# Altium schematic sheet Power_Switch.SchDoc: Evaluation Board 3.2
size A3; Organization: Toradex AG; Address1: Altsagenstrasse 5; Address2: Horw; Address3: 6048; Address4: Switzerland; DocumentNumber: 3; Revision: V3.2; SheetNumber: 3; SheetTotal: 23; PageSetup: Record=PageOptions|CenterHorizontal=True|CenterVertical=True|PrintScale=0.73|XCorrection=1.00|YCorrection=1.00|PrintKind=0|BorderSize=5000000|LeftOffset=0|BottomOffset=0|Orientation=2|PaperLength=1000|PaperWidth=1000|Scale=100|PaperSource=7|PrintQuality=-4|MediaType=1|DitherType=10|PaperKind=A4|PrintScaleMode=1
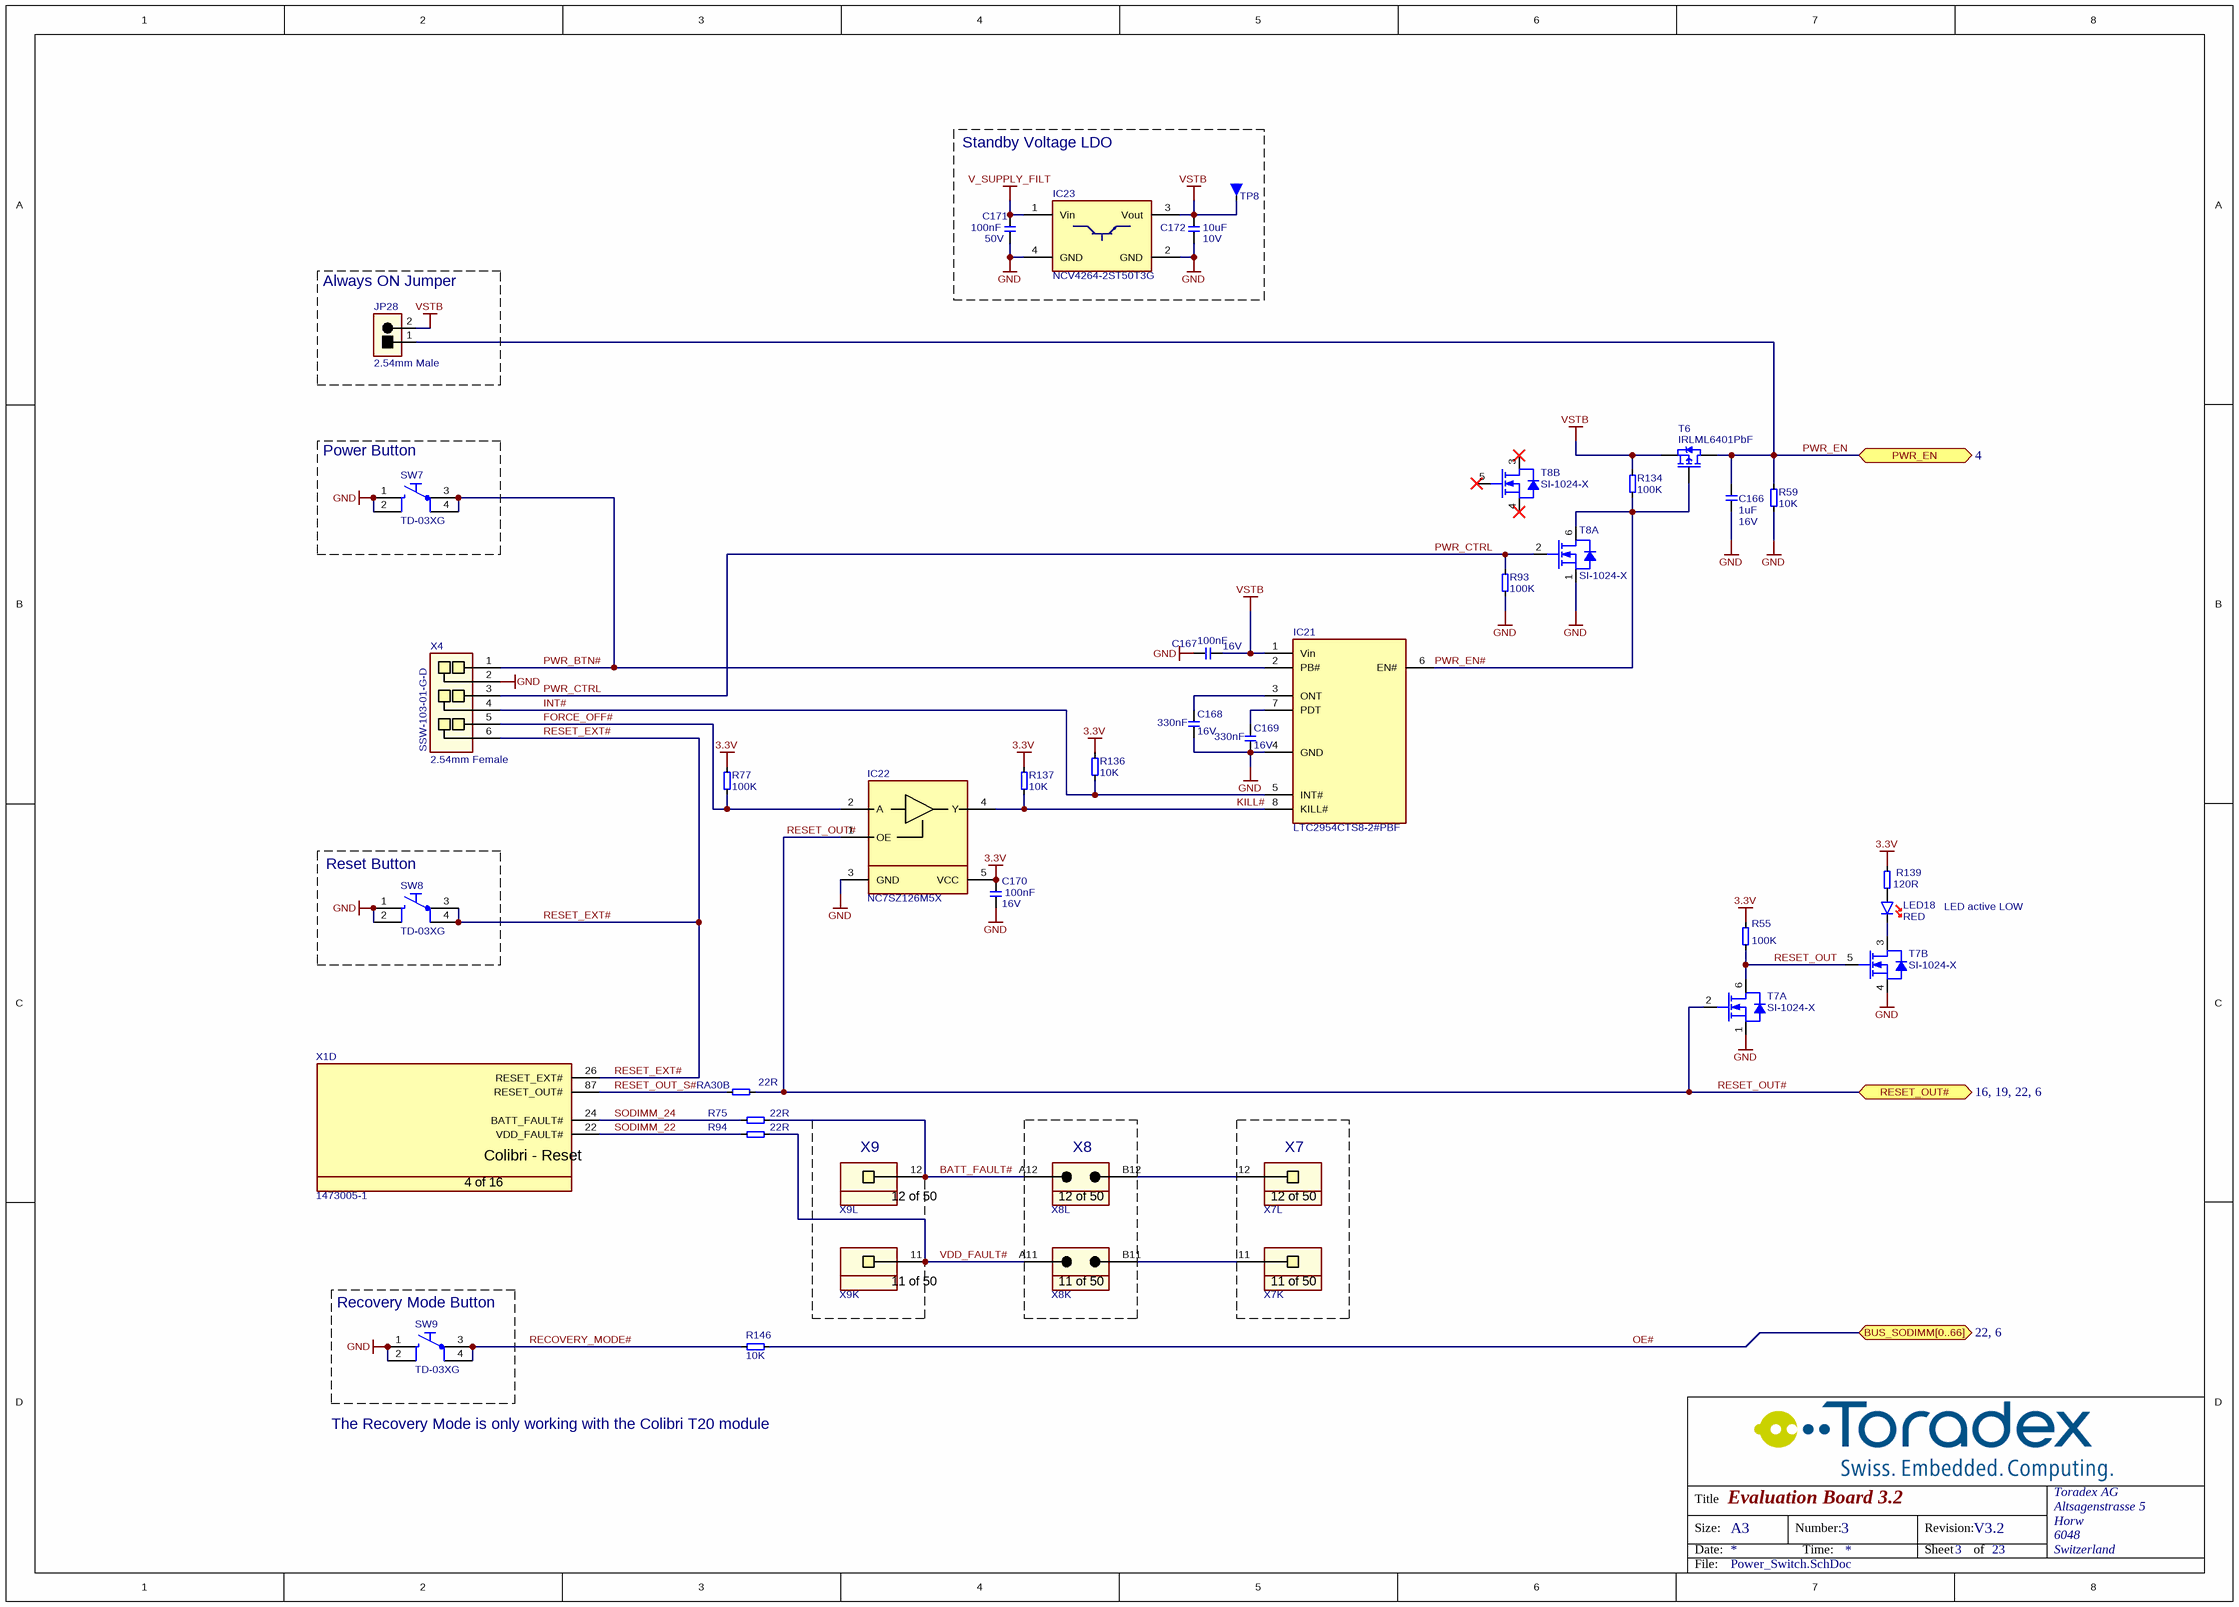
[diagram p0: Power_Switch.SchDoc]

## Parts
C166  Rating: 16V  [T_CAPC0603X33N]  (hidden comment: 1uF)
C167  Rating: 16V  [T_CAPC0603X33N]  (hidden comment: 100nF)
C168  Rating: 16V  [T_CAPC0805X125N]  (hidden comment: 330nF)
C169  Rating: 16V  [T_CAPC0805X125N]  (hidden comment: 330nF)
C170  Rating: 16V  [T_CAPC0603X33N]  (hidden comment: 100nF)
C171  Rating: 50V  [T_CAPC0603X33N]  (hidden comment: 100nF)
C172  Rating: 10V  [T_CAPC0805X125N]  (hidden comment: 10uF)
IC21  LTC2954CTS8-2#PBF  [T_LINEAR_LTC2954CTS8-2#PBF]
IC22  NC7SZ126M5X  [SOT95P279X142-5N]
IC23  NCV4264-2ST50T3G  [T_ON_NCV4264-2ST50T3G]
JP28  TSW-101-07-G-D  [T_Samtec_TSW-101-07-G-D]  (value not drawn)
LED18  Color: RED  [T_Osram_T670_RED]  (hidden comment: LS T670-K1L2-1)
R55  100K  [T_RESC0603X30N]
R59  10K  [T_RESC0603X30N]
R75  22R  [RESC1005X40N]
R77  100K  [T_RESC0603X30N]
R93  100K  [T_RESC0603X30N]
R94  22R  [RESC1005X40N]
R134  100K  [T_RESC0603X30N]
R136  10K  [T_RESC0603X30N]
R137  10K  [T_RESC0603X30N]
R139  120R  [T_RESC0603X30N]
R146  10K  [T_RESC0603X30N]
RA30  22R  [T_Resistor_Array_X4]  (part B of 4)
SW7  TD-03XG  [T_WMF_TD-03XG]
SW8  TD-03XG  [T_WMF_TD-03XG]
SW9  TD-03XG  [T_WMF_TD-03XG]
T6  IRLML6401PbF  [SOT95P237X112-3N]
T7  Manufacturer Part No.: SI-1024-X  [SOTFL50P160X60-6N]  (hidden comment: T-Vishay-SI-1024X-N)  (parts A,B of 2)
T8  Manufacturer Part No.: SI-1024-X  [SOTFL50P160X60-6N]  (hidden comment: T-Vishay-SI-1024X-N)  (parts A,B of 2)
TP8  Testpin  [T_TP-THT]  (value not drawn)
X1  Manufacturer Part No.: 1473005-1  [T_Tyco_1473005-1]  (hidden comment: CON-Tyco-1473005-1-200-0.6mm)  (part D of 16)
X4  Manufacturer Part No.: SSW-103-01-G-D  [T_Samtec_SSW-103-01-G-D]  (hidden comment: TSW-103-01-G-D)
X7  SSW-110-01-G-S  [T_Samtec_SSW-110-01-G-S]  (value not drawn)  (parts K,L of 50)
X8  TSW-110-07-G-D  [T_Samtec_TSW-110-07-G-D]  (value not drawn)  (parts K,L of 50)
X9  SSW-110-01-G-S  [T_Samtec_SSW-110-01-G-S]  (value not drawn)  (parts K,L of 50)

## Blocks framed on the sheet
Standby Voltage LDO: C171 C172 IC23 TP8
Always ON Jumper: JP28
Power Button: SW7
Reset Button: SW8
X9: X9
X8: X8
X7: X7
Recovery Mode Button: SW9

## Ports
BUS_SODIMM[0..66] (bidir, see 22, 6), PWR_EN (bidir, see 4), RESET_OUT# (bidir, see 16, 19, 22, 6)

## Nets
3.3V: C170.1 IC22.5(VCC) R55.2 R77.2 R136.1 R137.1 R139.2
GND: C166.1 C167.1 C168.1 C169.1 C170.2 C171.1 C172.1 IC21.4(GND) IC22.3(GND) IC23.2(GND) IC23.4(GND) R59.1 R93.1 SW7.1 SW7.2 SW8.1 SW8.2 SW9.1 SW9.2 T7.1(S) T7.4(S) T8.1(S) X4.2
V_SUPPLY_FILT: C171.2 IC23.1(Vin)
VSTB: C167.2 C172.2 IC21.1(Vin) IC23.3(Vout) JP28.2 R134.2 T6.2 TP8.1
BATT_FAULT#: R75.2 X8.A12 X9.12
FORCE_OFF#: IC22.2(A) R77.1 X4.5
INT#: IC21.5(INT#) R136.2 X4.4
KILL#: IC21.8(KILL#) IC22.4(Y) R137.2
OE#: R146.2
PWR_BTN#: IC21.2(PB#) SW7.3 SW7.4 X4.1
PWR_CTRL: R93.2 T8.2(G) X4.3
PWR_EN: C166.2 JP28.1 R59.2 T6.3 ; port PWR_EN
PWR_EN#: IC21.6(EN#) R134.1 T6.1 T8.6(D)
RECOVERY_MODE#: R146.1 SW9.3 SW9.4
RESET_EXT#: SW8.3 SW8.4 X1.26(RESET_EXT#) X4.6
RESET_OUT: R55.1 T7.5(G) T7.6(D)
RESET_OUT#: IC22.1(OE) RA30.6 T7.2(G) ; port RESET_OUT#
RESET_OUT_S#: RA30.2 X1.87(RESET_OUT#)
SODIMM_22: R94.1 X1.22(VDD_FAULT#)
SODIMM_24: R75.1 X1.24(BATT_FAULT#)
VDD_FAULT#: R94.2 X8.A11 X9.11
NetC168_2: C168.2 IC21.3(ONT)
NetC169_2: C169.2 IC21.7(PDT)
NetLED18_A: LED18.A R139.1
NetLED18_K: LED18.K T7.3(D)
NetX7_11: X7.11 X8.B11
NetX7_12: X7.12 X8.B12

Not connected (* = marked no-connect by the designer): T8 3(D)* 4(S)* 5(G)*

## Notes on the sheet
- (near JP28) 2.54mm Male
- (near X4) 2.54mm Female
- LED active LOW
- The Recovery Mode is only working with the Colibri T20 module
- Title
- Size:
- Date:
- A3
- Number:
- Time:
- Revision:
- Sheet
- of
- File:
- (in symbol CON-Samtec-SSW-110-01-G-S, part K) 11 of 50
- (in symbol CON-Samtec-SSW-110-01-G-S, part L) 12 of 50
- (in symbol CON-Samtec-TSW-110-07-G-D, part K) 11 of 50
- (in symbol CON-Samtec-TSW-110-07-G-D, part L) 12 of 50
- (in symbol CON-Tyco-1473005-1-200-0.6mm, part D) Colibri - Reset; 4 of 16

## Library data of the parts
C166 = C-X5R-1uF-16V-20%-0603: Capacitor Ceramic X5R 1uF 16V 20% 0603; Tolerance: 20%; Type: X5R; Value: 1uF
C167 C170 = C-X7R-100nF-16V-10%-0603: Capacitor Ceramic X7R 100nF 16V 10% 0603; Tolerance: 10%; Type: X7R; Value: 100nF
C168 C169 = C-X7R-330nF-16V-10%-0805: Capacitor Ceramic X7R 330nF 16V 10% 0805; Tolerance: 10%; Type: X7R; Value: 330nF
C171 = C-X7R-100nF-50V-20%-0603: Capacitor Ceramic X7R 100nF 50V 20% 0603; Tolerance: 20%; Type: X7R; Value: 100nF
C172 = C-X5R-10uF-10V-20%-0805: Capacitor Ceramic X5R 10uF 10V 20% 0805; Tolerance: 20%; Type: X5R; Value: 10uF
IC21 = IC-LIN-LTC2954CTS8-2#PBF: Push Button On/Off Controller; Manufacturer Name: Linear; Manufacturer Part No.: LTC2954CTS8-2#PBF
IC22 = IC-FAR-NC7SZ126M5X: NC7SZ126M5X  Buffer Three-State Output; Manufacturer Name: Fairchild Semiconductor; Manufacturer Part No.: NC7SZ126M5X
IC23 = IC-ON-NCV4264-2ST50T3G: NCV4264-2ST50T3G LDO Regulator; Manufacturer Name: ON Semiconductor; Manufacturer Part No.: NCV4264-2ST50T3G
JP28 = CON-Samtec-TSW-101-07-G-D: Header male, 1x2 Pins, 2.54 mm pitch; Manufacturer Name: Samtec; Pitch: 2.54 mm; No. of ways: 1x2; Manufacturer Part no.: TSW-101-07-G-D
LED18 = LED-Osram-LS T670-K1L2-1: LED red, Osram LS T670-K1L2-1; Manufacturer Part N.: LS T670-K1L2-1; Manufacturer Name: Osram
R55 R77 R93 R134 = R-100KR-63mW-5%-0603: Resistor 100 Kohm 63mW 5% 0603; Value: 100KR; Rating: 63mW; Tolerance: 5%
R59 R136 R137 R146 = R-10KR-63mW-5%-0603: Resistor 10 Kohm 63mW 5% 0603; Value: 10KR; Rating: 63mW; Tolerance: 5%
R75 R94 = R-22R-63mW-5%-0402: Resistor 22 ohm 63mW 5% 0402; Rating: 63mW; Tolerance: 5%; Value: 22R
R139 = R-120R-63mW-5%-0603: Resistor 120 ohm 63mW 5% 0603; Rating: 63mW; Tolerance: 5%; Value: 120R
RA30 = RA-22R-63mW-5%-1206-div: Resistor Array 22 R 63mW 5% 1206; Tolerance: 5%; Power Dissipation: 63mW; Value: 22R
SW7-SW9 = SW-WMF-TD-03XG: Switch; Manufacturer Name: WMF; Rating: 50mA; Manufacturer Part No.: TD-03XG
T6 = T-IR-IRLML6401PbF-SOT-23: p-channel MOSFET, IRLML6401PbF; Manufacturer Name: International Rectifier; Manufacturer Part No.: IRLML6401PbF
T7 T8 = T-Vishay-SI-1024X-N: Dual N-Channel 20V (D-S)  MOSFET; Manufacturer Name: Vishay
TP8 = Testpin: Testpin TH
X1 = CON-Tyco-1473005-1-200-0.6mm: SODIMM Connector; Manufacturer Name: Tyco; No. of ways: 200
X4 = CON-Samtec-SSW-103-01-G-D: Header Female, 2x3 Pins, 2.54mm pitch; Manufacturer Name: Samtec; No. of ways: 2x3; Pitch: 2.54mm
X7 X9 = CON-Samtec-SSW-110-01-G-S: Header 1x50 pin 2.54mm pitch; Manufacturer Name: Samtec; Pitch: 2.54mm; No. of ways: 1x50; Manufacturer Part No.: SSW-110-01-G-S
X8 = CON-Samtec-TSW-110-07-G-D: Header 2x50 pin 2.54mm pitch; Manufacturer Name: Samtec; Pitch: 2.54mm; No. of ways: 2x50; Manufacturer Part No.: TSW-110-07-G-D